# EAGLE schematic mainboard (EAGLE 9.6.2)
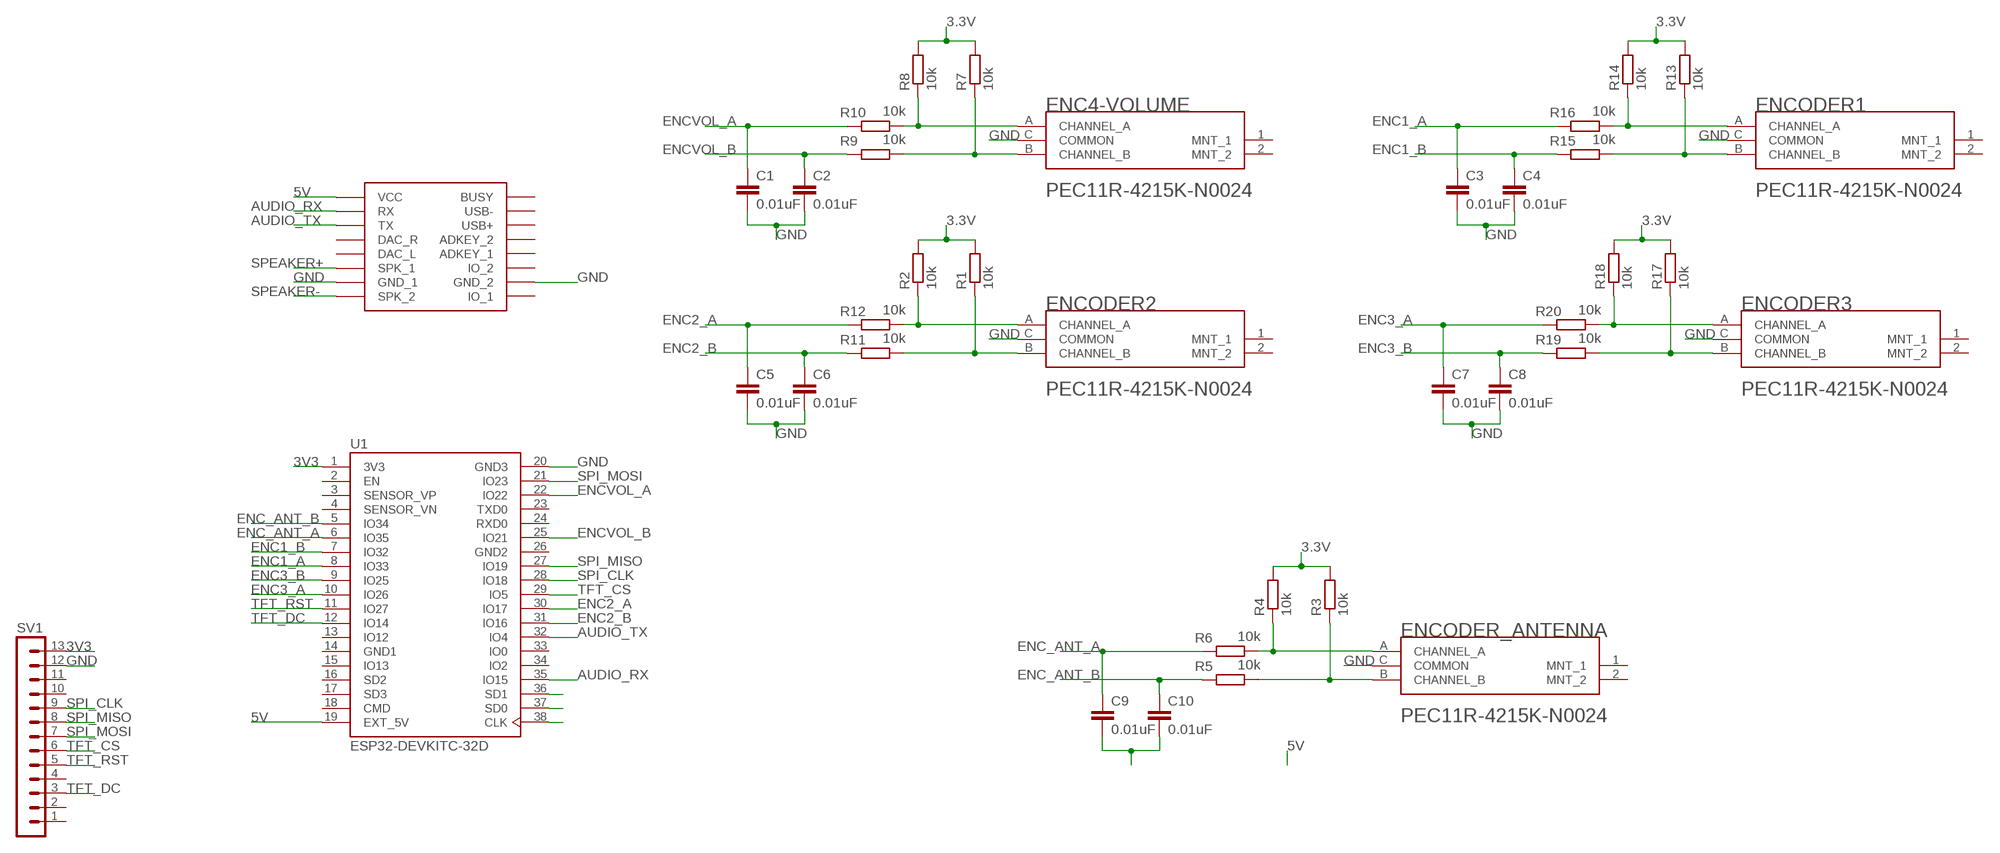
[diagram p0: schematic, sheet 1]

## Parts
C1  0.01uF  C2,5-3  [C2.5-3]
C2  0.01uF  C2,5-3  [C2.5-3]
C3  0.01uF  C2,5-3  [C2.5-3]
C4  0.01uF  C2,5-3  [C2.5-3]
C5  0.01uF  C2,5-3  [C2.5-3]
C6  0.01uF  C2,5-3  [C2.5-3]
C7  0.01uF  C2,5-3  [C2.5-3]
C8  0.01uF  C2,5-3  [C2.5-3]
C9  0.01uF  C2,5-3  [C2.5-3]
C10  0.01uF  C2,5-3  [C2.5-3]
ENC4-VOLUME  BOURNS_PEC11R-4215K-N0024BOURNS_PEC11R-4215K-N0024_0_0  [BOURNS_PEC11R-4215K-N0024_0]
ENCODER1  BOURNS_PEC11R-4215K-N0024BOURNS_PEC11R-4215K-N0024_0_0  [BOURNS_PEC11R-4215K-N0024_0]
ENCODER2  BOURNS_PEC11R-4215K-N0024BOURNS_PEC11R-4215K-N0024_0_0  [BOURNS_PEC11R-4215K-N0024_0]
ENCODER3  BOURNS_PEC11R-4215K-N0024BOURNS_PEC11R-4215K-N0024_0_0  [BOURNS_PEC11R-4215K-N0024_0]
ENCODER_ANTENNA  BOURNS_PEC11R-4215K-N0024BOURNS_PEC11R-4215K-N0024_0_0  [BOURNS_PEC11R-4215K-N0024_0]
R1  10k  R-EU_0204/7  [0204/7]
R2  10k  R-EU_0204/7  [0204/7]
R3  10k  R-EU_0204/7  [0204/7]
R4  10k  R-EU_0204/7  [0204/7]
R5  10k  R-EU_0204/7  [0204/7]
R6  10k  R-EU_0204/7  [0204/7]
R7  10k  R-EU_0204/7  [0204/7]
R8  10k  R-EU_0204/7  [0204/7]
R9  10k  R-EU_0204/7  [0204/7]
R10  10k  R-EU_0204/7  [0204/7]
R11  10k  R-EU_0204/7  [0204/7]
R12  10k  R-EU_0204/7  [0204/7]
R13  10k  R-EU_0204/7  [0204/7]
R14  10k  R-EU_0204/7  [0204/7]
R15  10k  R-EU_0204/7  [0204/7]
R16  10k  R-EU_0204/7  [0204/7]
R17  10k  R-EU_0204/7  [0204/7]
R18  10k  R-EU_0204/7  [0204/7]
R19  10k  R-EU_0204/7  [0204/7]
R20  10k  R-EU_0204/7  [0204/7]
SV1  MA13-1  [MA13-1]
U1  ESP32-DEVKITC-32D  [MODULE_ESP32-DEVKITC-32D]
U$1  DFPLAYER  [DFPLAYER]

## Nets
3.3V: R1.2 R2.2 R3.2 R4.2 R7.2 R8.2 R13.2 R14.2 R17.2 R18.2
3V3: SV1.13 U1.1(3V3)
5V: U1.19(EXT_5V) U$1.VCC
AUDIO_RX: U1.35(IO15) U$1.RX
AUDIO_TX: U1.32(IO4) U$1.TX
ENC1_A: C3.1 R16.1 U1.27(IO19)
ENC1_B: C4.1 R15.1 U1.28(IO18)
ENC2_A: C5.1 R12.1 U1.30(IO17)
ENC2_B: C6.1 R11.1 U1.31(IO16)
ENC3_A: C7.1 R20.1 U1.11(IO27)
ENC3_B: C8.1 R19.1 U1.10(IO26)
ENC_ANT_A: C9.1 R6.1 U1.6(IO35)
ENC_ANT_B: C10.1 R5.1 U1.5(IO34)
ENCVOL_A: C1.1 R10.1 U1.22(IO22)
ENCVOL_B: C2.1 R9.1 U1.25(IO21)
GND: C1.2 C2.2 C3.2 C4.2 C5.2 C6.2 C7.2 C8.2 C9.2 C10.2 ENC4-VOLUME.C(COMMON) ENCODER1.C(COMMON) ENCODER2.C(COMMON) ENCODER3.C(COMMON) ENCODER_ANTENNA.C(COMMON) SV1.12 U1.20(GND3) U$1.GND_1 U$1.GND_2
N$1: U1.21(IO23)
N$2: ENCODER2.A(CHANNEL_A) R2.1 R12.2
N$3: U1.8(IO33)
N$4: U1.29(IO5)
N$5: ENC4-VOLUME.A(CHANNEL_A) R8.1 R10.2
N$6: ENC4-VOLUME.B(CHANNEL_B) R7.1 R9.2
N$8: ENCODER_ANTENNA.A(CHANNEL_A) R4.1 R6.2
N$9: ENCODER2.B(CHANNEL_B) R1.1 R11.2
N$11: ENCODER1.A(CHANNEL_A) R14.1 R16.2
N$12: ENCODER1.B(CHANNEL_B) R13.1 R15.2
N$14: ENCODER3.A(CHANNEL_A) R18.1 R20.2
N$15: ENCODER3.B(CHANNEL_B) R17.1 R19.2
N$17: ENCODER_ANTENNA.B(CHANNEL_B) R3.1 R5.2
SPEAKER+: U$1.SPK1(SPK_1)
SPEAKER-: U$1.SPK2(SPK_2)
SPI_CLK: SV1.9 U1.38(CLK)
SPI_MISO: SV1.8 U1.36(SD1)
SPI_MOSI: SV1.7 U1.37(SD0)
TFT_CS: SV1.6 U1.7(IO32)
TFT_DC: SV1.3 U1.12(IO14)
TFT_RST: SV1.5 U1.9(IO25)
Unconnected: ENC4-VOLUME.1(MNT_1) ENC4-VOLUME.2(MNT_2) ENCODER1.1(MNT_1) ENCODER1.2(MNT_2) ENCODER2.1(MNT_1) ENCODER2.2(MNT_2) ENCODER3.1(MNT_1) ENCODER3.2(MNT_2) ENCODER_ANTENNA.1(MNT_1) ENCODER_ANTENNA.2(MNT_2) SV1.1 SV1.2 SV1.4 SV1.10 SV1.11 U1.2(EN) U1.3(SENSOR_VP) U1.4(SENSOR_VN) U1.13(IO12) U1.15(IO13) U1.16(SD2) U1.17(SD3) U1.18(CMD) U1.23(TXD0) U1.24(RXD0) U1.33(IO0) U1.34(IO2) U$1.ADKEY1(ADKEY_1) U$1.ADKEY2(ADKEY_2) U$1.BUSY U$1.DAC_L U$1.DAC_R U$1.IO1(IO_1) U$1.IO2(IO_2) U$1.USB+ U$1.USB-

## Power pins joined to a net without a drawn wire
GND1: U1.14(GND1)
GND2: U1.26(GND2)

## Library data of the parts
C1-C10 = capacitor-wima:C: CAPACITOR naming: grid - package width
ENC4-VOLUME ENCODER1-ENCODER3 ENCODER_ANTENNA = Bourns - PEC11R-4215K-N0024:BOURNS_PEC11R-4215K-N0024: Rotary Encoder Mechanical 24 Quadrature (Incremental) Vertical; AUTOMOTIVE: No; CENTROID_NOT_SPECIFIED: No; CONN_ORIENTATION: Vertical; CURRENT_RATING: 10mA; DATASHEET: https://www.bourns.com/docs/product-datasheets/pec11r.pdf?sfvrsn=bb617cbf_7; DETENT: Yes; DEVICE_CLASS_L1: Electromechanical; DEVICE_CLASS_L2: Switches; DEVICE_CLASS_L3: Encoders; DIGIKEY_DESCRIPTION: ROTARY ENCODER MECHANICAL 24PPR; DIGIKEY_PART_NUMBER: PEC11R-4215K-N0024-ND; ENCODER_TYPE: Mechanical; FOOTPRINT_VARIANT_NAME_0: Recommended_Land_Pattern; HEIGHT: 22.3mm; LEAD_FREE: Yes; MF: Bourns; MFG_PACKAGE_IDENT: PEC11R; MFG_PACKAGE_IDENT_DATE: 0; MFG_PACKAGE_IDENT_REV: 0; MOUSER_DESCRIPTION: Encoders 15mm SHAFT NO SWITCH; MOUSER_PART_NUMBER: 652-PEC11R-4215K-N24; MPN: PEC11R-4215K-N0024; PACKAGE: PTH_ENC_12MM4_13MM4; PREFIX: ENC; PULSES_PER_REV: 24; ROHS: Yes; TEMPERATURE_RANGE_HIGH: +70°C; TEMPERATURE_RANGE_LOW: -30°C; VERIFICATION_VERSION: 0.0.0.3; VOLTAGE_RATING_DC: 5V
R1-R20 = rcl:R-EU_: RESISTOR, European symbol; SPICEPREFIX: R
SV1 = con-lstb:MA13-1: PIN HEADER; OC_FARNELL: unknown; OC_NEWARK: unknown
U1 = ESP32-DEVKITC-32D_2:ESP32-DEVKITC-32D: Eval Board For Esp-Wroom-32 Check prices <https://pricing.snapeda.com/parts/ESP32-DEVKITC-32D/Espressif%20Systems/view-part?ref=eda>; AVAILABILITY: In Stock; DESCRIPTION: WiFi Development Tools (802.11) ESP32 General Development Kit, ESP32-WROOM-32D on the board; MF: Espressif Systems; MP: ESP32-DEVKITC-32D; PACKAGE: None; PRICE: None; PURCHASE-URL: https://pricing.snapeda.com/search/part/ESP32-DEVKITC-32D/?ref=eda
U$1 = DFPlayer_v1:DFPLAYER

## Module NEW
Ports: 

### Library data of the parts